# EAGLE schematic Singularitron 1B (EAGLE 7.7.0)

## Sheet 1 of 8
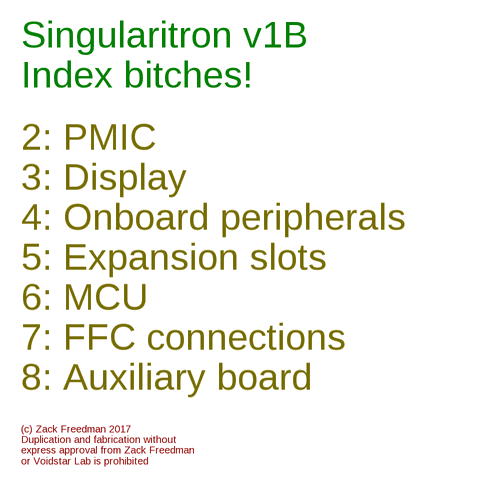
[diagram p0: schematic, sheet 1]

### Notes on the sheet
- Singularitron v1B
  Index bitches!
- 2: PMIC
  3: Display
  4: Onboard peripherals
  5: Expansion slots
  6: MCU
  7: FFC connections
  8: Auxiliary board
- (c) Zack Freedman 2017
  Duplication and fabrication without 
  express approval from Zack Freedman 
  or Voidstar Lab is prohibited

## Sheet 2 of 8
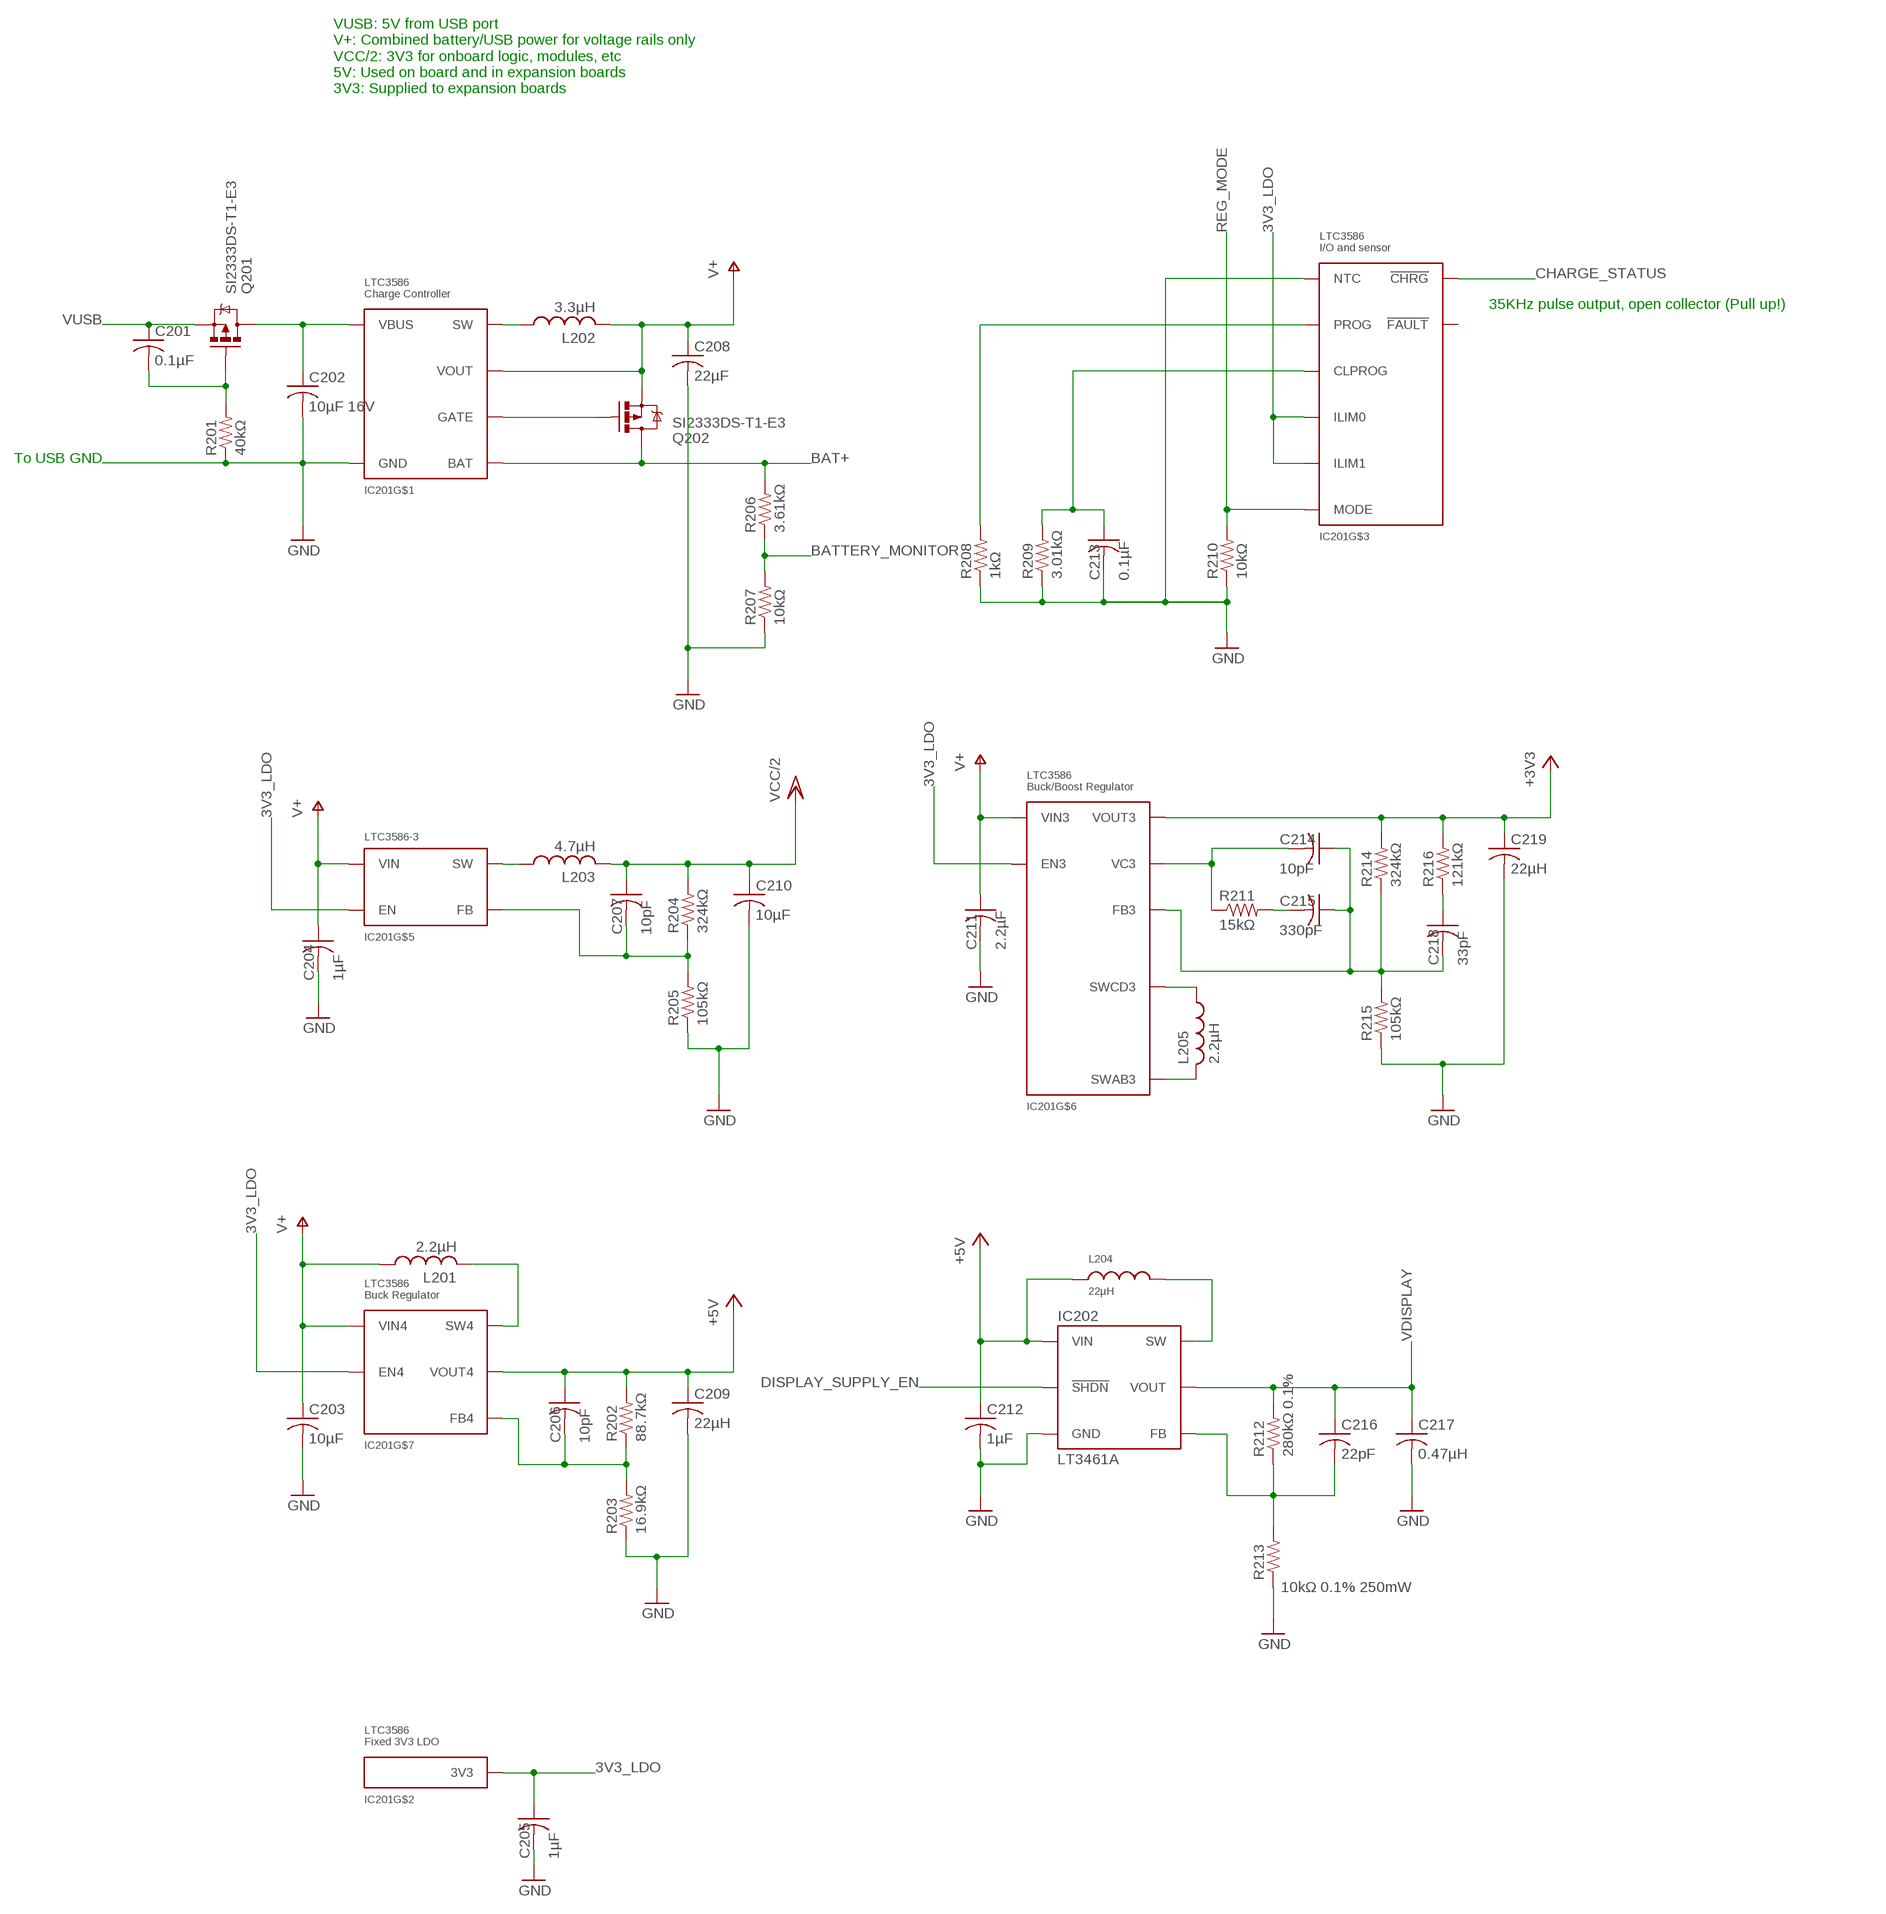
[diagram p1: schematic, sheet 2]

### Parts
C201  0.1µF  C-USC0603  [C0603]
C202  10µF 16V  C-USC0805  [C0805]
C203  10µF  C-USC0805  [C0805]
C204  1µF  C-USC0603  [C0603]
C205  1µF  C-USC0603  [C0603]
C206  10pF  C-USC0603  [C0603]
C207  10pF  C-USC0603  [C0603]
C208  22µF  C-USC1210  [C1210]
C209  22µH  C-USC1210  [C1210]
C210  10µF  C-USC0805  [C0805]
C211  2.2µF  C-USC0603  [C0603]
C212  1µF  C-USC0805  [C0805]
C213  0.1µF  C-USC0603  [C0603]
C214  10pF  C-USC0603  [C0603]
C215  330pF  C-USC0603  [C0603]
C216  22pF  C-USC0805  [C0805]
C217  0.47µH  C-USC1210  [C1210]
C218  33pF  C-USC0603  [C0603]
C219  22µH  C-USC1210  [C1210]
IC201  LTC3586-3  [QFN-38_EP_UFE]
IC202  LT3461A  [SOT-23]
L201  2.2µH  CDRH4D22/HP  [CDRH4D22/HP]
L202  3.3µH  CDRH6D12  [CDRH6D12]
L203  4.7µH  CDRH3D16/HP  [CDRH3D16/HP]
L204  22µH  SUMIDA_CDPH4D19F  [CDPH4D19F]
L205  2.2µH  CDRH4D22/HP  [CDRH4D22/HP]
Q201  SI2333DS-T1-E3  MOSFET-PCHANNELSMD  [SOT23-3]
Q202  SI2333DS-T1-E3  MOSFET-PCHANNELSMD  [SOT23-3]
R201  40kΩ  R-US_R0603  [R0603]
R202  88.7kΩ  R-US_R0603  [R0603]
R203  16.9kΩ  R-US_R0603  [R0603]
R204  324kΩ  R-US_R0603  [R0603]
R205  105kΩ  R-US_R0603  [R0603]
R206  3.61kΩ  R-US_R0603  [R0603]
R207  10kΩ  R-US_R0603  [R0603]
R208  1kΩ  R-US_R0603  [R0603]
R209  3.01kΩ  R-US_R0603  [R0603]
R210  10kΩ  R-US_R0603  [R0603]
R211  15kΩ  R-US_R0603  [R0603]
R212  280kΩ 0.1%  R-US_R0603  [R0603]
R213  10kΩ 0.1% 250mW  R-US_R0805  [R0805]
R214  324kΩ  R-US_R0603  [R0603]
R215  105kΩ  R-US_R0603  [R0603]
R216  121kΩ  R-US_R0603  [R0603]

### Nets
3V3_LDO: C205.1 IC201.P$1(ILIM0) IC201.P$2(ILIM1) IC201.P$3(3V3) IC201.P$18(EN3) IC201.P$20(EN) IC201.P$33(EN4) ; also sheet 6
+3V3: C219.1 IC201.P$16(VOUT3) IC201.P$17(VOUT3) R214.2 R216.2 ; also sheet 5
+5V: C206.1 C209.1 C212.1 IC201.P$6(VOUT4) IC201.P$7(VOUT4) IC202.P6(VIN) L204.P$1 R202.2 ; also sheet 3,5
BAT+: IC201.P$32(BAT) Q202.3(D) R206.2 ; also sheet 7
BATTERY_MONITOR: R206.1 R207.2 ; also sheet 6
CHARGE_STATUS: IC201.P$30(!CHRG) ; also sheet 6
CLPROG: C213.1 IC201.P$4(CLPROG) R209.2
DISPLAY_SUPPLY_EN: IC202.P4(!SHDN) ; also sheet 6
GND: C202.2 C203.2 C204.2 C205.2 C208.2 C209.2 C210.2 C211.2 C212.2 C213.2 C217.2 C219.2 IC201.EP(GND) IC201.P$5(NTC) IC202.P2(GND) R201.1 R203.1 R205.1 R207.1 R208.1 R209.1 R210.1 R213.1 R215.1 ; also sheet 3,4,5,6,7
N$1: C202.1 IC201.P$35(VBUS) IC201.P$36(VBUS) Q201.3(D)
N$2: IC201.P$37(SW) L202.P$1
N$4: C201.2 Q201.1(G) R201.2
N$6: IC201.P$31(GATE) Q202.1(G)
N$17: IC201.P$25(SW) L203.P$1
N$22: IC201.P$29(PROG) R208.2
N$24: C207.2 IC201.P$23(FB) R204.1 R205.2
N$27: IC202.P1(SW) L204.P$2
N$30: C214.2 IC201.P$12(VC3) R211.1
N$31: C216.2 IC202.P3(FB) R212.1 R213.2
N$34: C215.2 R211.2
N$35: IC201.P$8(SW4) L201.P$2
N$37: C218.1 R216.1
N$38: C206.2 IC201.P$10(FB4) R202.1 R203.2
N$39: C214.1 C215.1 C218.2 IC201.P$11(FB3) R214.1 R215.2
N$41: IC201.P$19(SWCD3) L205.P$1
N$42: IC201.P$13(SWAB3) L205.P$2
REG_MODE: IC201.P$9(MODE) R210.2
V+: C203.1 C204.1 C208.1 C211.1 IC201.P$14(VIN3) IC201.P$15(VIN3) IC201.P$22(VIN4) IC201.P$24(VIN) IC201.P$34(VOUT) L201.P$1 L202.P$3 Q202.2(S)
VCC/2: C207.1 C210.1 L203.P$2 R204.2 ; also sheet 3,4,5,6,7
VDISPLAY: C216.1 C217.1 IC202.P5(VOUT) R212.2 ; also sheet 3
VUSB: C201.1 Q201.2(S) ; also sheet 7
Unconnected: IC201.P$21(EN) IC201.P$26(SW) IC201.P$27(VIN) IC201.P$28(FB) IC201.P$38(!FAULT)

### Notes on the sheet
- VUSB: 5V from USB port
  V+: Combined battery/USB power for voltage rails only
  VCC/2: 3V3 for onboard logic, modules, etc
  5V: Used on board and in expansion boards
  3V3: Supplied to expansion boards
- 35KHz pulse output, open collector (Pull up!)
- To USB GND

## Sheet 3 of 8
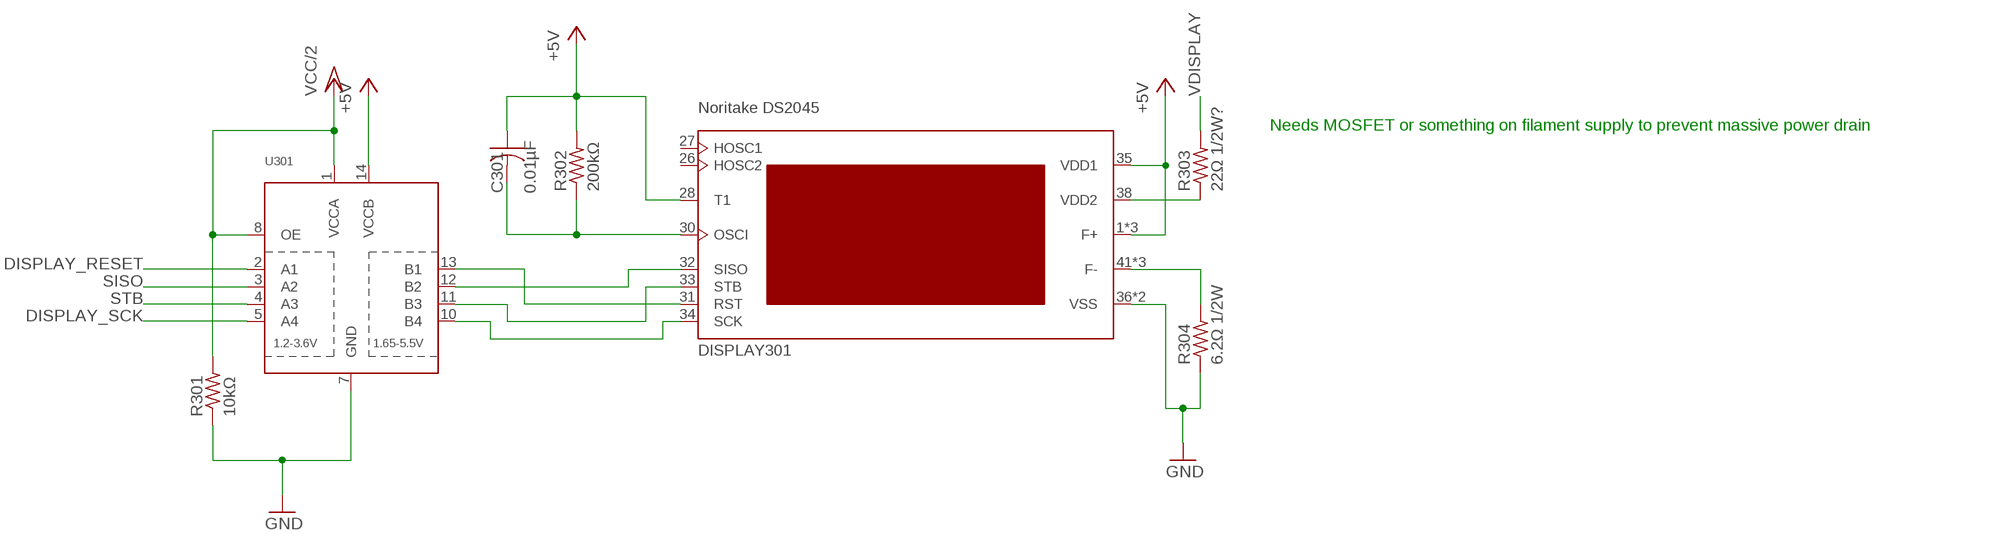
[diagram p2: schematic, sheet 3]

### Parts
C301  0.01µF  C-USC0603  [C0603]
DISPLAY301  DS2045  [DS2045]
R301  10kΩ  R-US_R0603  [R0603]
R302  200kΩ  R-US_R0603  [R0603]
R303  22Ω 1/2W?  R-US_R0805  [R0805]
R304  6.2Ω 1/2W  R-US_R0805  [R0805]
U301  TXB0104PWR  [TSSOP14]

### Nets
+5V: C301.1 DISPLAY301.1(F+) DISPLAY301.2(F+) DISPLAY301.3(F+) DISPLAY301.28(T1) DISPLAY301.35(VDD1) R302.2 U301.14(VCCB) ; also sheet 2,5
DISPLAY_RESET: U301.2(A1) ; also sheet 6
DISPLAY_SCK: U301.5(A4) ; also sheet 6
GND: DISPLAY301.36(VSS) DISPLAY301.37(VSS) R301.1 R304.1 U301.7(GND) ; also sheet 2,4,5,6,7
N$5: DISPLAY301.31(RST) U301.13(B1)
N$7: DISPLAY301.38(VDD2) R303.1
N$8: DISPLAY301.41(F-) DISPLAY301.42(F-) DISPLAY301.43(F-) R304.2
N$9: DISPLAY301.32(SISO) U301.12(B2)
N$10: DISPLAY301.33(STB) U301.11(B3)
N$11: DISPLAY301.34(SCK) U301.10(B4)
N$13: C301.2 DISPLAY301.30(OSCI) R302.1
SISO: U301.3(A2) ; also sheet 6
STB: U301.4(A3) ; also sheet 6
VCC/2: R301.2 U301.1(VCCA) U301.8(OE) ; also sheet 2,4,5,6,7
VDISPLAY: R303.2 ; also sheet 2
Unconnected: DISPLAY301.26(HOSC2) DISPLAY301.27(HOSC1)

### Notes on the sheet
- Needs MOSFET or something on filament supply to prevent massive power drain

## Sheet 4 of 8
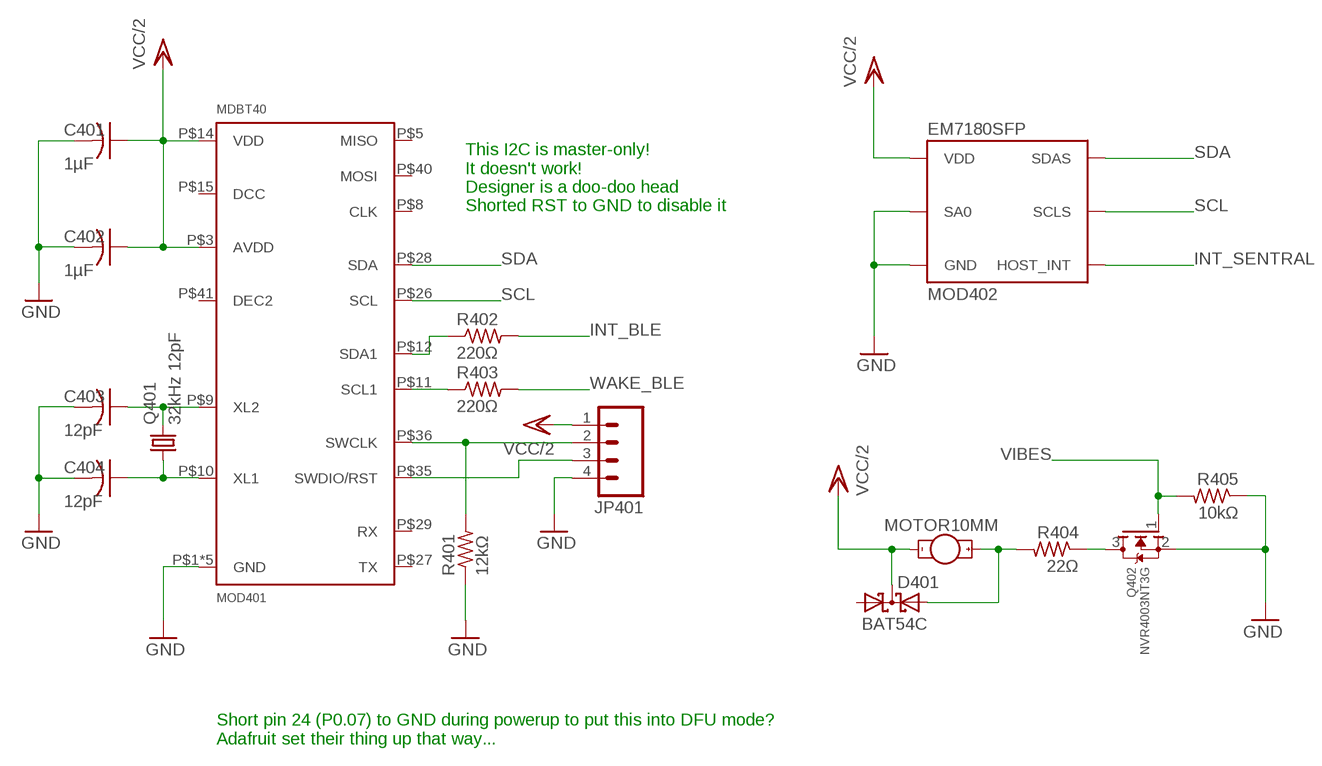
[diagram p3: schematic, sheet 4]

### Parts
C401  1µF  C-USC0603  [C0603]
C402  1µF  C-USC0603  [C0603]
C403  12pF  C-USC0603  [C0603]
C404  12pF  C-USC0603  [C0603]
D401  BAT54C  [SOT23]
JP401  M041.27MM  [1X04-1.27MM]
MOD401  MDBT40  [MDBT40]
MOD402  EM7180SFP  [EM7180SFP]
MOTOR401  MOTOR10MM  [VIBE-MOTOR-10MM]
Q401  32kHz 12pF  FC-12M  [FC-12M]
Q402  NVR4003NT3G  MOSFET-NREFLOW  [SOT23]
R401  12kΩ  R-US_R0603  [R0603]
R402  220Ω  R-US_R0603  [R0603]
R403  220Ω  R-US_R0603  [R0603]
R404  22Ω  R-US_R0603  [R0603]
R405  10kΩ  R-US_R0603  [R0603]

### Nets
GND: C401.2 C402.2 C403.2 C404.2 JP401.4 MOD401.P$1(GND) MOD401.P$2(GND) MOD401.P$13(GND) MOD401.P$25(GND) MOD401.P$42(GND) MOD402.P$5(SA0) MOD402.P$6(GND) Q402.2(S) R401.1 R405.1 ; also sheet 2,3,5,6,7
INT_BLE: R402.2 ; also sheet 6
INT_SENTRAL: MOD402.P$4(HOST_INT) ; also sheet 6
N$16: MOD401.P$12(SDA1) R402.1
N$25: D401.2(A2) MOTOR401.+ R404.2
N$29: MOD401.P$11(SCL1) R403.1
N$32: Q402.3(D) R404.1
N$36: C404.1 MOD401.P$10(XL1) Q401.1
N$40: C403.1 MOD401.P$9(XL2) Q401.2
N$43: JP401.2 MOD401.P$36(SWCLK) R401.2
N$44: JP401.3 MOD401.P$35(SWDIO/RST)
SCL: MOD401.P$26(SCL) MOD402.P$3(SCLS) ; also sheet 5,6,7
SDA: MOD401.P$28(SDA) MOD402.P$2(SDAS) ; also sheet 5,6,7
VCC/2: C401.1 C402.1 D401.3(CC) JP401.1 MOD401.P$3(AVDD) MOD401.P$14(VDD) MOD402.P$1(VDD) MOTOR401.- ; also sheet 2,3,5,6,7
VIBES: Q402.1(G) R405.2 ; also sheet 6
WAKE_BLE: R403.2 ; also sheet 6
Unconnected: D401.1(A1) MOD401.P$5(MISO) MOD401.P$8(CLK) MOD401.P$15(DCC) MOD401.P$27(TX) MOD401.P$29(RX) MOD401.P$40(MOSI) MOD401.P$41(DEC2)

### Notes on the sheet
- This I2C is master-only!
  It doesn't work!
  Designer is a doo-doo head
  Shorted RST to GND to disable it
- Short pin 24 (P0.07) to GND during powerup to put this into DFU mode?
  Adafruit set their thing up that way...

## Sheet 5 of 8
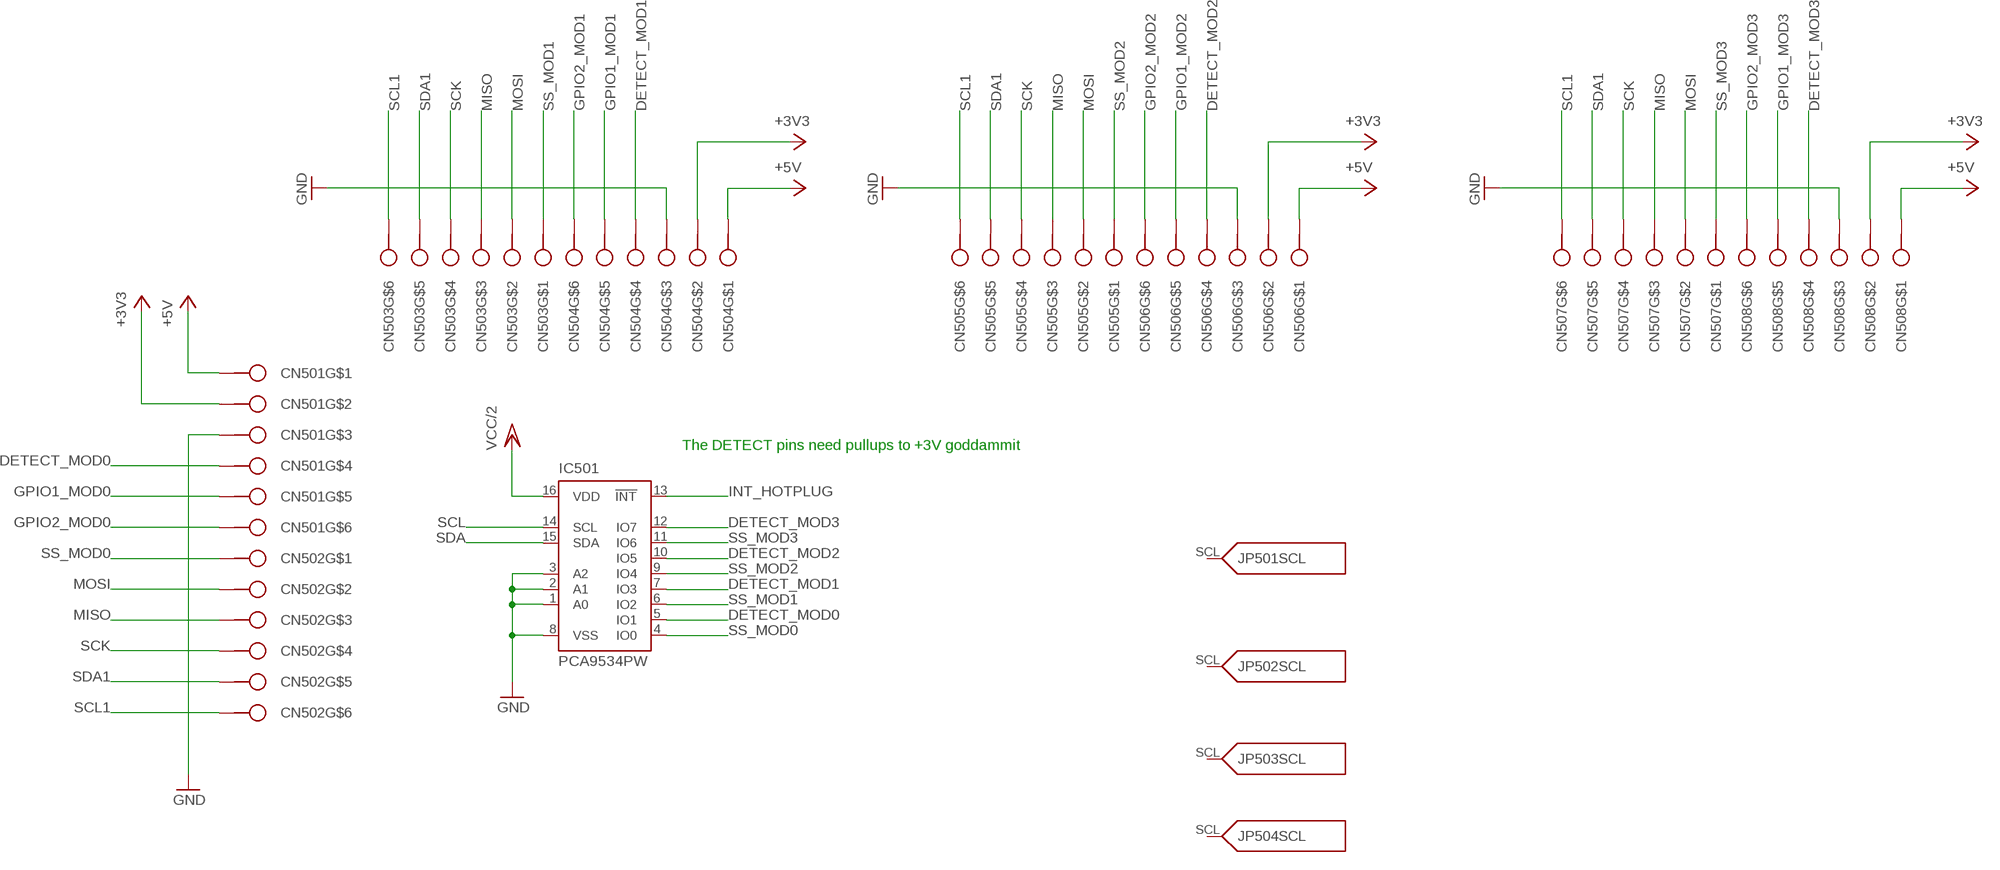
[diagram p4: schematic, sheet 5]

### Parts
CN501  AVX_9155066  [9155006]
CN502  AVX_9155066  [9155006]
CN503  AVX_9155066  [9155006]
CN504  AVX_9155066  [9155006]
CN505  AVX_9155066  [9155006]
CN506  AVX_9155066  [9155006]
CN507  AVX_9155066  [9155006]
CN508  AVX_9155066  [9155006]
IC501  PCA9534PW  [TSSOP16]
JP501  SINGULARITRON_CART_BASE  [SINGULARITRON_CART_BASE]
JP502  SINGULARITRON_CART_BASE  [SINGULARITRON_CART_BASE]
JP503  SINGULARITRON_CART_BASE  [SINGULARITRON_CART_BASE]
JP504  SINGULARITRON_CART_BASE  [SINGULARITRON_CART_BASE]

### Nets
+3V3: CN501.PAD2 CN504.PAD2 CN506.PAD2 CN508.PAD2 ; also sheet 2
+5V: CN501.PAD1 CN504.PAD1 CN506.PAD1 CN508.PAD1 ; also sheet 2,3
DETECT_MOD0: CN501.PAD4 IC501.5(IO1)
DETECT_MOD1: CN504.PAD4 IC501.7(IO3)
DETECT_MOD2: CN506.PAD4 IC501.10(IO5)
DETECT_MOD3: CN508.PAD4 IC501.12(IO7)
GND: CN501.PAD3 CN504.PAD3 CN506.PAD3 CN508.PAD3 IC501.1(A0) IC501.2(A1) IC501.3(A2) IC501.8(VSS) ; also sheet 2,3,4,6,7
GPIO1_MOD0: CN501.PAD5 ; also sheet 6
GPIO1_MOD1: CN504.PAD5 ; also sheet 6
GPIO1_MOD2: CN506.PAD5 ; also sheet 6
GPIO1_MOD3: CN508.PAD5 ; also sheet 6
GPIO2_MOD0: CN501.PAD6 ; also sheet 6
GPIO2_MOD1: CN504.PAD6 ; also sheet 6
GPIO2_MOD2: CN506.PAD6 ; also sheet 6
GPIO2_MOD3: CN508.PAD6 ; also sheet 6
INT_HOTPLUG: IC501.13(!INT) ; also sheet 6
MISO: CN502.PAD3 CN503.PAD3 CN505.PAD3 CN507.PAD3 ; also sheet 6
MOSI: CN502.PAD2 CN503.PAD2 CN505.PAD2 CN507.PAD2 ; also sheet 6
SCK: CN502.PAD4 CN503.PAD4 CN505.PAD4 CN507.PAD4 ; also sheet 6
SCL: IC501.14(SCL) ; also sheet 4,6,7
SCL1: CN502.PAD6 CN503.PAD6 CN505.PAD6 CN507.PAD6 ; also sheet 6
SDA: IC501.15(SDA) ; also sheet 4,6,7
SDA1: CN502.PAD5 CN503.PAD5 CN505.PAD5 CN507.PAD5 ; also sheet 6
SS_MOD0: CN502.PAD1 IC501.4(IO0)
SS_MOD1: CN503.PAD1 IC501.6(IO2)
SS_MOD2: CN505.PAD1 IC501.9(IO4)
SS_MOD3: CN507.PAD1 IC501.11(IO6)
VCC/2: IC501.16(VDD) ; also sheet 2,3,4,6,7
Unconnected: JP501.3V3 JP501.5V JP501.DETECT JP501.GND JP501.GPIO1 JP501.GPIO2 JP501.MISO JP501.MOSI JP501.SCK JP501.SCL JP501.SDA JP501.SS JP502.3V3 JP502.5V JP502.DETECT JP502.GND JP502.GPIO1 JP502.GPIO2 JP502.MISO JP502.MOSI JP502.SCK JP502.SCL JP502.SDA JP502.SS JP503.3V3 JP503.5V JP503.DETECT JP503.GND JP503.GPIO1 JP503.GPIO2 JP503.MISO JP503.MOSI JP503.SCK JP503.SCL JP503.SDA JP503.SS JP504.3V3 JP504.5V JP504.DETECT JP504.GND JP504.GPIO1 JP504.GPIO2 JP504.MISO JP504.MOSI JP504.SCK JP504.SCL JP504.SDA JP504.SS

### Notes on the sheet
- The DETECT pins need pullups to +3V goddammit

## Sheet 6 of 8
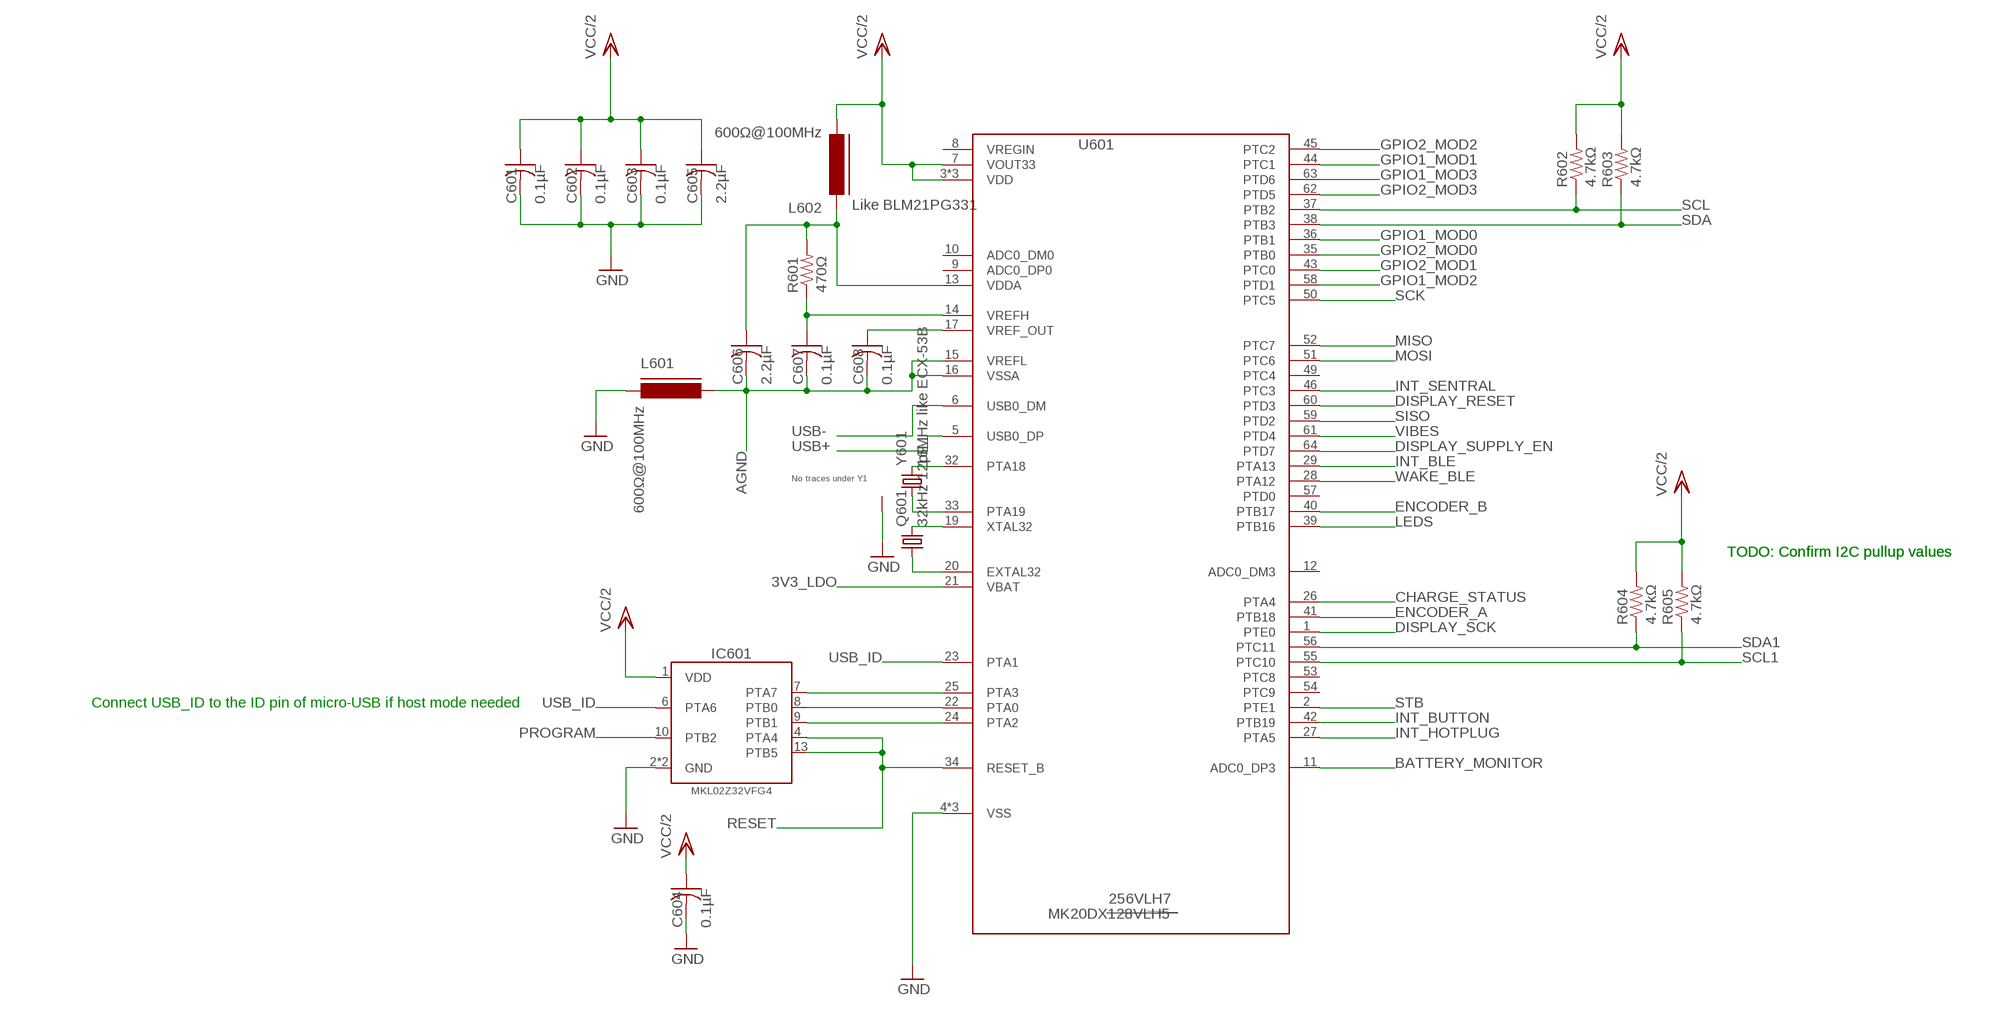
[diagram p5: schematic, sheet 6]

### Parts
C601  0.1µF  C-USC0603  [C0603]
C602  0.1µF  C-USC0603  [C0603]
C603  0.1µF  C-USC0603  [C0603]
C604  0.1µF  C-USC0603  [C0603]
C605  2.2µF  C-USC0603  [C0603]
C606  2.2µF  C-USC0603  [C0603]
C607  0.1µF  C-USC0603  [C0603]
C608  0.1µF  C-USC0603  [C0603]
IC601  MKL02Z32VFG4  [QFN16-3X3]
L601  600Ω@100MHz  FERRITE-0603  [FB603]
L602  600Ω@100MHz  FERRITE-0603  [FB603]
Q601  32kHz 12pF  FC-12M  [FC-12M]
R601  470Ω  R-US_R0603  [R0603]
R602  4.7kΩ  R-US_R0603  [R0603]
R603  4.7kΩ  R-US_R0603  [R0603]
R604  4.7kΩ  R-US_R0603  [R0603]
R605  4.7kΩ  R-US_R0603  [R0603]
U601  MK20DX128VLH5  [MK20DX128VLH5]
Y601  16MHz like ECX-53B  CRYSTAL-SHIELDED  [CRYSTAL-SMD-5X3]

### Nets
3V3_LDO: U601.21(VBAT) ; also sheet 2
AGND: C606.2 C607.2 C608.2 L601.1 U601.15(VREFL) U601.16(VSSA)
BATTERY_MONITOR: U601.11(ADC0_DP3) ; also sheet 2
CHARGE_STATUS: U601.26(PTA4) ; also sheet 2
DISPLAY_RESET: U601.60(PTD3) ; also sheet 3
DISPLAY_SCK: U601.1(PTE0) ; also sheet 3
DISPLAY_SUPPLY_EN: U601.64(PTD7) ; also sheet 2
ENCODER_A: U601.41(PTB18) ; also sheet 7
ENCODER_B: U601.40(PTB17) ; also sheet 7
GND: C601.2 C602.2 C603.2 C604.2 C605.2 IC601.2(GND) IC601.PAD(GND) L601.2 U601.4(VSS) U601.31(VSS) U601.47(VSS) Y601.2(SHIELD) Y601.4(SHIELD) ; also sheet 2,3,4,5,7
GPIO1_MOD0: U601.36(PTB1) ; also sheet 5
GPIO1_MOD1: U601.44(PTC1) ; also sheet 5
GPIO1_MOD2: U601.58(PTD1) ; also sheet 5
GPIO1_MOD3: U601.63(PTD6) ; also sheet 5
GPIO2_MOD0: U601.35(PTB0) ; also sheet 5
GPIO2_MOD1: U601.43(PTC0) ; also sheet 5
GPIO2_MOD2: U601.45(PTC2) ; also sheet 5
GPIO2_MOD3: U601.62(PTD5) ; also sheet 5
INT_BLE: U601.29(PTA13) ; also sheet 4
INT_BUTTON: U601.42(PTB19) ; also sheet 7
INT_HOTPLUG: U601.27(PTA5) ; also sheet 5
INT_SENTRAL: U601.46(PTC3) ; also sheet 4
LEDS: U601.39(PTB16) ; also sheet 7
MISO: U601.52(PTC7) ; also sheet 5
MOSI: U601.51(PTC6) ; also sheet 5
N$3: IC601.7(PTA7) U601.25(PTA3)
N$12: IC601.8(PTB0) U601.22(PTA0)
N$14: IC601.9(PTB1) U601.24(PTA2)
N$18: U601.32(PTA18) Y601.3
N$19: U601.33(PTA19) Y601.1
N$20: Q601.2 U601.19(XTAL32)
N$21: Q601.1 U601.20(EXTAL32)
N$23: C608.1 U601.17(VREF_OUT)
N$26: C607.1 R601.1 U601.14(VREFH)
N$28: C606.1 L602.1 R601.2 U601.13(VDDA)
PROGRAM: IC601.10(PTB2) ; also sheet 7
RESET: IC601.4(PTA4) IC601.13(PTB5) U601.34(RESET_B)
SCK: U601.50(PTC5) ; also sheet 5
SCL: R602.1 U601.37(PTB2) ; also sheet 4,5,7
SCL1: R605.1 U601.55(PTC10) ; also sheet 5
SDA: R603.1 U601.38(PTB3) ; also sheet 4,5,7
SDA1: R604.1 U601.56(PTC11) ; also sheet 5
SISO: U601.59(PTD2) ; also sheet 3
STB: U601.2(PTE1) ; also sheet 3
USB+: U601.5(USB0_DP) ; also sheet 7
USB-: U601.6(USB0_DM) ; also sheet 7
USB_ID: IC601.6(PTA6) U601.23(PTA1)
VCC/2: C601.1 C602.1 C603.1 C604.1 C605.1 IC601.1(VDD) L602.2 R602.2 R603.2 R604.2 R605.2 U601.3(VDD) U601.7(VOUT33) U601.30(VDD) U601.48(VDD) ; also sheet 2,3,4,5,7
VIBES: U601.61(PTD4) ; also sheet 4
WAKE_BLE: U601.28(PTA12) ; also sheet 4
Unconnected: U601.8(VREGIN) U601.9(ADC0_DP0) U601.10(ADC0_DM0) U601.12(ADC0_DM3) U601.49(PTC4) U601.53(PTC8) U601.54(PTC9) U601.57(PTD0)

### Notes on the sheet
- Like BLM21PG331
- No traces under Y1
- TODO: Confirm I2C pullup values | TODO: Confirm I2C pullup values
- Connect USB_ID to the ID pin of micro-USB if host mode needed
- 256VLH7

## Sheet 7 of 8
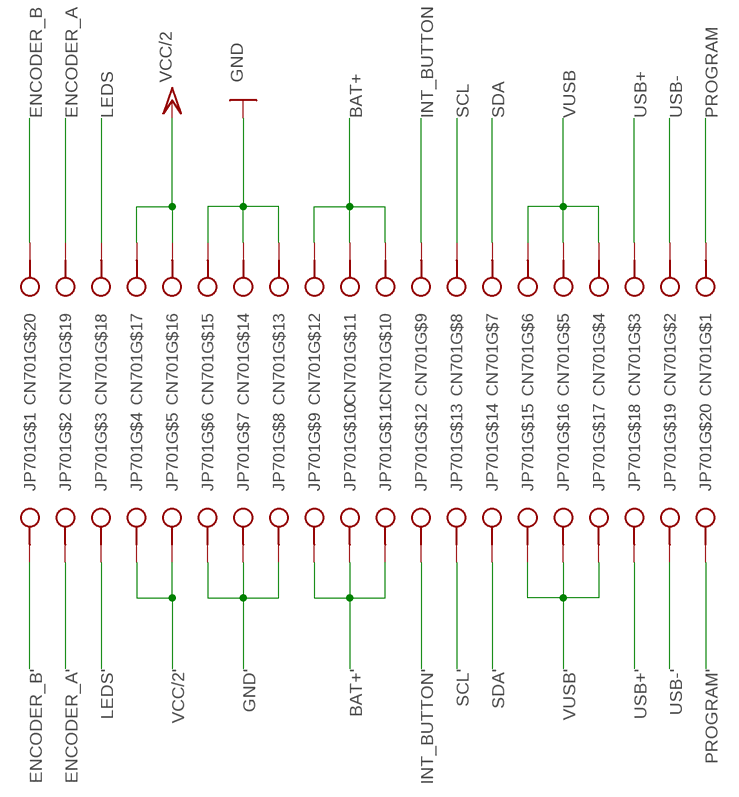
[diagram p6: schematic, sheet 7]

### Parts
CN701  HFW20R-1ST  [HFW20R-1STE1LF]
JP701  FFC_1MM_20POS_DIRECT  [FFC_1MM_20POS_DIRECT]

### Nets
BAT+: CN701.P$10 CN701.P$11 CN701.P$12 ; also sheet 2
BAT+': JP701.P$9 JP701.P$10 JP701.P$11 ; also sheet 8
ENCODER_A: CN701.P$19 ; also sheet 6
ENCODER_A': JP701.P$2 ; also sheet 8
ENCODER_B: CN701.P$20 ; also sheet 6
ENCODER_B': JP701.P$1 ; also sheet 8
GND: CN701.P$13 CN701.P$14 CN701.P$15 ; also sheet 2,3,4,5,6
GND': JP701.P$6 JP701.P$7 JP701.P$8 ; also sheet 8
INT_BUTTON: CN701.P$9 ; also sheet 6
INT_BUTTON': JP701.P$12 ; also sheet 8
LEDS: CN701.P$18 ; also sheet 6
LEDS': JP701.P$3 ; also sheet 8
PROGRAM: CN701.P$1 ; also sheet 6
PROGRAM': JP701.P$20 ; also sheet 8
SCL: CN701.P$8 ; also sheet 4,5,6
SCL': JP701.P$13 ; also sheet 8
SDA: CN701.P$7 ; also sheet 4,5,6
SDA': JP701.P$14 ; also sheet 8
USB+: CN701.P$3 ; also sheet 6
USB+': JP701.P$18 ; also sheet 8
USB-: CN701.P$2 ; also sheet 6
USB-': JP701.P$19 ; also sheet 8
VCC/2: CN701.P$16 CN701.P$17 ; also sheet 2,3,4,5,6
VCC/2': JP701.P$4 JP701.P$5 ; also sheet 8
VUSB: CN701.P$4 CN701.P$5 CN701.P$6 ; also sheet 2
VUSB': JP701.P$15 JP701.P$16 JP701.P$17 ; also sheet 8

## Sheet 8 of 8
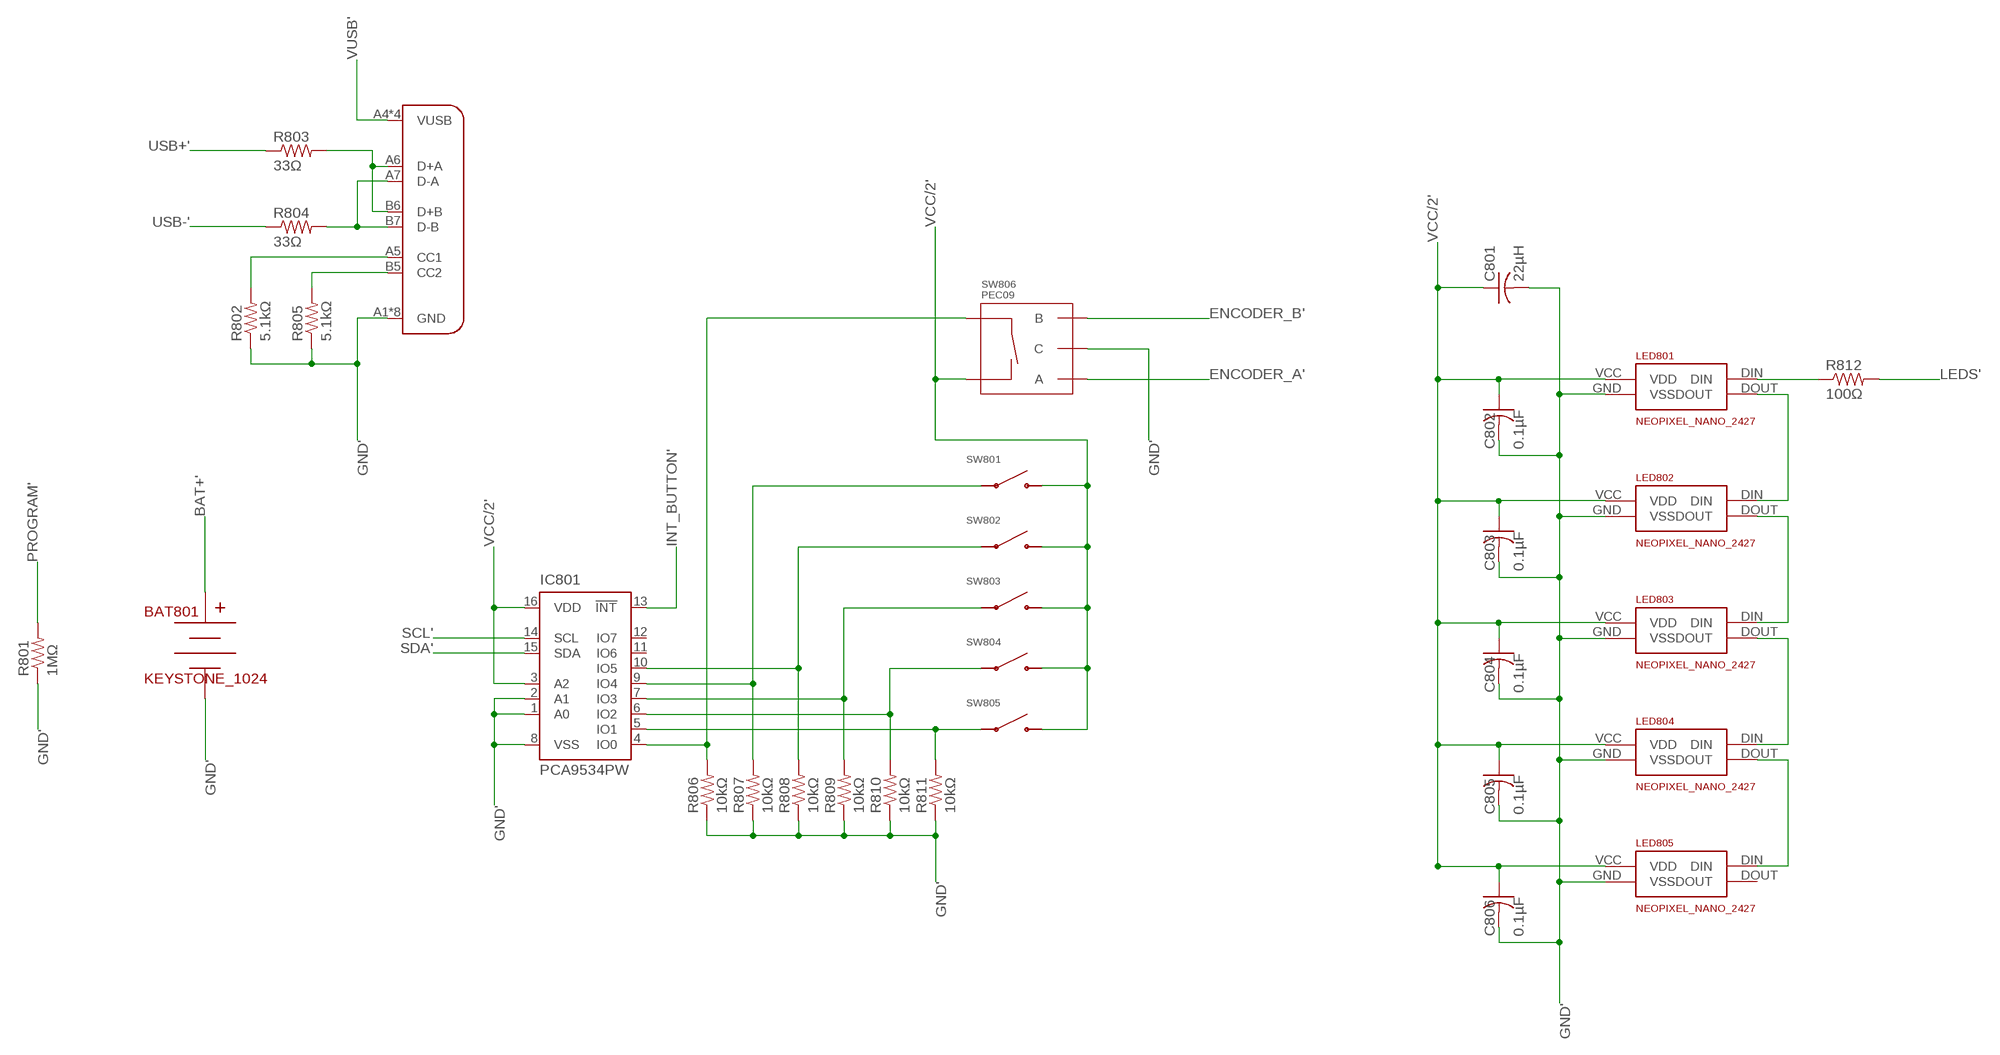
[diagram p7: schematic, sheet 8]

### Parts
BAT801  KEYSTONE_1024  [KEYSTONE-1024-PROVISIONAL]
C801  22µH  C-USC1210  [C1210]
C802  0.1µF  C-USC0603  [C0603]
C803  0.1µF  C-USC0603  [C0603]
C804  0.1µF  C-USC0603  [C0603]
C805  0.1µF  C-USC0603  [C0603]
C806  0.1µF  C-USC0603  [C0603]
CN801  12401548E4#2A  [12401548E4#2A]
IC801  PCA9534PW  [TSSOP16]
LED801  NEOPIXEL_NANO_2427  [SK6805-2427]
LED802  NEOPIXEL_NANO_2427  [SK6805-2427]
LED803  NEOPIXEL_NANO_2427  [SK6805-2427]
LED804  NEOPIXEL_NANO_2427  [SK6805-2427]
LED805  NEOPIXEL_NANO_2427  [SK6805-2427]
R801  1MΩ  R-US_R0603  [R0603]
R802  5.1kΩ  R-US_R0603  [R0603]
R803  33Ω  R-US_R0603  [R0603]
R804  33Ω  R-US_R0603  [R0603]
R805  5.1kΩ  R-US_R0603  [R0603]
R806  10kΩ  R-US_R0603  [R0603]
R807  10kΩ  R-US_R0603  [R0603]
R808  10kΩ  R-US_R0603  [R0603]
R809  10kΩ  R-US_R0603  [R0603]
R810  10kΩ  R-US_R0603  [R0603]
R811  10kΩ  R-US_R0603  [R0603]
R812  100Ω  R-US_R0603  [R0603]
SW801  TACTILE_SWITCHTL3301-G  [TL3301-X-FXXX-X-G]
SW802  TACTILE_SWITCHTL3301-G  [TL3301-X-FXXX-X-G]
SW803  TACTILE_SWITCHTL3301-G  [TL3301-X-FXXX-X-G]
SW804  TACTILE_SWITCHTL3301-G  [TL3301-X-FXXX-X-G]
SW805  TACTILE_SWITCHTL3301-G  [TL3301-X-FXXX-X-G]
SW806  PEC09  [PEC09-2X20X-TXXXX]

### Nets
BAT+': BAT801.+(V+) ; also sheet 7
ENCODER_A': SW806.A ; also sheet 7
ENCODER_B': SW806.B ; also sheet 7
GND': BAT801.-(V-) C801.2 C802.2 C803.2 C804.2 C805.2 C806.2 CN801.A1(GND) CN801.A12(GND) CN801.B1(GND) CN801.B12(GND) CN801.SHIELD1(GND) CN801.SHIELD2(GND) CN801.SHIELD3(GND) CN801.SHIELD4(GND) IC801.1(A0) IC801.2(A1) IC801.8(VSS) LED801.GND(VSS) LED802.GND(VSS) LED803.GND(VSS) LED804.GND(VSS) LED805.GND(VSS) R801.1 R802.1 R805.1 R806.1 R807.1 R808.1 R809.1 R810.1 R811.1 SW806.C ; also sheet 7
INT_BUTTON': IC801.13(!INT) ; also sheet 7
LEDS': R812.2 ; also sheet 7
N$15: CN801.A6(D+A) CN801.B6(D+B) R803.2
N$33: IC801.5(IO1) R811.2 SW805.P$1 SW805.P$2
N$45: IC801.6(IO2) R810.2 SW804.P$1 SW804.P$2
N$47: IC801.7(IO3) R809.2 SW803.P$1 SW803.P$2
N$48: CN801.A7(D-A) CN801.B7(D-B) R804.2
N$49: IC801.10(IO5) R808.2 SW802.P$1 SW802.P$2
N$50: IC801.9(IO4) R807.2 SW801.P$1 SW801.P$2
N$51: LED801.DOUT LED802.DIN
N$52: LED802.DOUT LED803.DIN
N$53: LED803.DOUT LED804.DIN
N$54: LED804.DOUT LED805.DIN
N$55: LED801.DIN R812.1
N$56: IC801.4(IO0) R806.2 SW806.D(SW+)
N$57: CN801.A5(CC1) R802.2
N$58: CN801.B5(CC2) R805.2
PROGRAM': R801.2 ; also sheet 7
SCL': IC801.14(SCL) ; also sheet 7
SDA': IC801.15(SDA) ; also sheet 7
USB+': R803.1 ; also sheet 7
USB-': R804.1 ; also sheet 7
VCC/2': C801.1 C802.1 C803.1 C804.1 C805.1 C806.1 IC801.3(A2) IC801.16(VDD) LED801.VCC(VDD) LED802.VCC(VDD) LED803.VCC(VDD) LED804.VCC(VDD) LED805.VCC(VDD) SW801.P$3 SW801.P$4 SW802.P$3 SW802.P$4 SW803.P$3 SW803.P$4 SW804.P$3 SW804.P$4 SW805.P$3 SW805.P$4 SW806.E(SW-) ; also sheet 7
VUSB': CN801.A4(VUSB) CN801.A9(VUSB) CN801.B4(VUSB) CN801.B9(VUSB) ; also sheet 7
Unconnected: IC801.11(IO6) IC801.12(IO7) LED805.DOUT

## Library data of the parts
BAT801 = Voidstar-Connectors:KEYSTONE_1024
C201-C219 C301 C401-C404 C601-C608 C801-C806 = rcl:C-US: CAPACITOR, American symbol
CN501-CN508 = Voidstar-Connectors:AVX_9155066: AVX 6-position 2mm pitch right-angle battery connector
CN701 = Voidstar-Connectors:HFW20R: Amphenol HF20R 20-contact 1mm-pitch FFC/FPC connector. No locking feature - friction only.
CN801 = Voidstar-Connectors:12401548E4#2A: Amphenol USB C receptacle, surface-mount and through-hole pins
D401 = diode:BAT54C: Schottky Diodes Source: Fairchild .. BAT54.pdf
DISPLAY301 = Voidstar-Exotic:DS2045
IC201 = Voidstar-Integrated:LTC3586-3: Linear LTC3586 PMIC Incorporates LiPo charge controller, 3v3 fixed LDO, two 400mA buck regulators, one 1A buck/boost regulator, and one 800mA boost regulator. Includes charge LED driver and NTP thermistor temperature sensor
IC202 = Voidstar-Integrated:LT3461A: Linear Technologies LT3461A 3MHz boost regulator, 16V max VIN, 38V max VOUT, 70mA output load current Same package can be used for the LT3461. Remember that it's a slower 1.3MHz regulator and needs bigger inductors.
IC501 IC801 = micro-philips:PCA9534: 8-bit I2C-bus and SMBus low power I/O port with interrupt Source: www.nxp.com .. PCA9534_3.pdf; MPN: PCA9534PW; OC_FARNELL: 1408285; OC_NEWARK: 18M7516
IC601 = teensy:MKL02Z32VFG4
JP401 = SparkFun-Connectors:M04: Header 4 Standard 4-pin 0.1" header. Use with straight break away headers (SKU : PRT-00116), right angle break away headers (PRT-00553), swiss pins (PRT-00743), machine pins (PRT-00117), and female headers (PRT-00115). Molex polarized connector foot print use with SKU : PRT-08231 with associated crimp pins and housings. 1MM SMD Version SKU: PRT-10208
JP501-JP504 = Voidstar-Exotic:SINGULARITRON_CART_BASE
JP701 = Voidstar-Connectors:FFC_1MM_20POS_DIRECT: 1mm-pitch, 20-position FFC glued and soldered directly to the PCB.
L201 L205 = Voidstar-Passive:CDRH4D22/HP: Sumida low-DCR shielded inductor
L202 = Voidstar-Passive:CDRH6D12: Sumida low-profile shielded inductor
L203 = Voidstar-Passive:CDRH3D16/HP: Sumida miniature low-profile shielded inductor
L204 = Voidstar-Discrete:SUMIDA_CDPH4D19F: Low-profile shielded inductor, proprietary footprint, useful for low-current switching regulators
L601 L602 = dp_devices:FERRITE: Ferrite bead in various packages
LED801-LED805 = NeoPixel Nano 2427:NEOPIXEL_NANO_2427
MOD401 = Voidstar-Exotic:MDBT40
MOD402 = Voidstar-Exotic:EM7180SFP: EM7180SFP Sensor fusion platform module. Incorporated EM7180 Sentral Hub coprocessor, Bosch BMX055 9-DOF IMU, and ST24256 32KB EEPROM. Axes are indicated on the tDocu layer. Decoupling caps are included on module. I2C pullups needed.
MOTOR401 = SparkFun-Electromechanical:MOTOR: Vibration Motor- ROB-08449 Physical dimension and wire connections for this powerful vibration motor. Motor has a self adhesive backing.
Q201 Q202 = SparkFun-DiscreteSemi:MOSFET-PCHANNEL: Generic PMOSFET
Q401 Q601 = crystal:FC-12M: kHz RANGE CRYSTAL UNIT LOW PROFILE SMD Source: Epson Toyocom FC-12M.pdf
Q402 = adafruit:MOSFET-N: N-Channel Mosfet 2N7002E - 60V 260mA SOT23 [Digikey: 2N7002ET1GOSTR-ND] - REEL BSH103 - 30V 850mA SOT23 [Digikey: 568-5013-1-ND]
R201-R216 R301-R304 R401-R405 R601-R605 R801-R812 = rcl:R-US_: RESISTOR, American symbol
SW801-SW805 = Voidstar-Electromechanical:TACTILE_SWITCH
SW806 = Voidstar-Electromechanical:PEC09: Bourns low-profile rotary encoders
U301 = SparkFun-DigitalIC:TXB0104PWR: 4-Bit Bi-Directional Level Shifter 1.2V-3.6V (VCCA) to 1.65V-5.5V (VCCB) bi-directional level shifter with auto direction sensing. Max data rate - VCCA 1.8V: 20Mbps (50ns), VCCA 3.3V: 100Mbps (10ns) Digikey: 296-21929-1-ND
U601 = TeensyCustom:MK20DX128VLH5: Teensy 3.0 Processing Unit - MK20DX128VLH5 ARM Cortex M0 Datasheet: http://cache.freescale.com/files/32bit/doc/data_sheet/K20P64M50SF0.pdf
Y601 = SparkFun-FreqCtrl:CRYSTAL-SHIELDED